# Altium schematic sheet Motor_Driver.SchDoc
size A3; DocumentNumber: 2; SheetNumber: 2; SheetTotal: 11
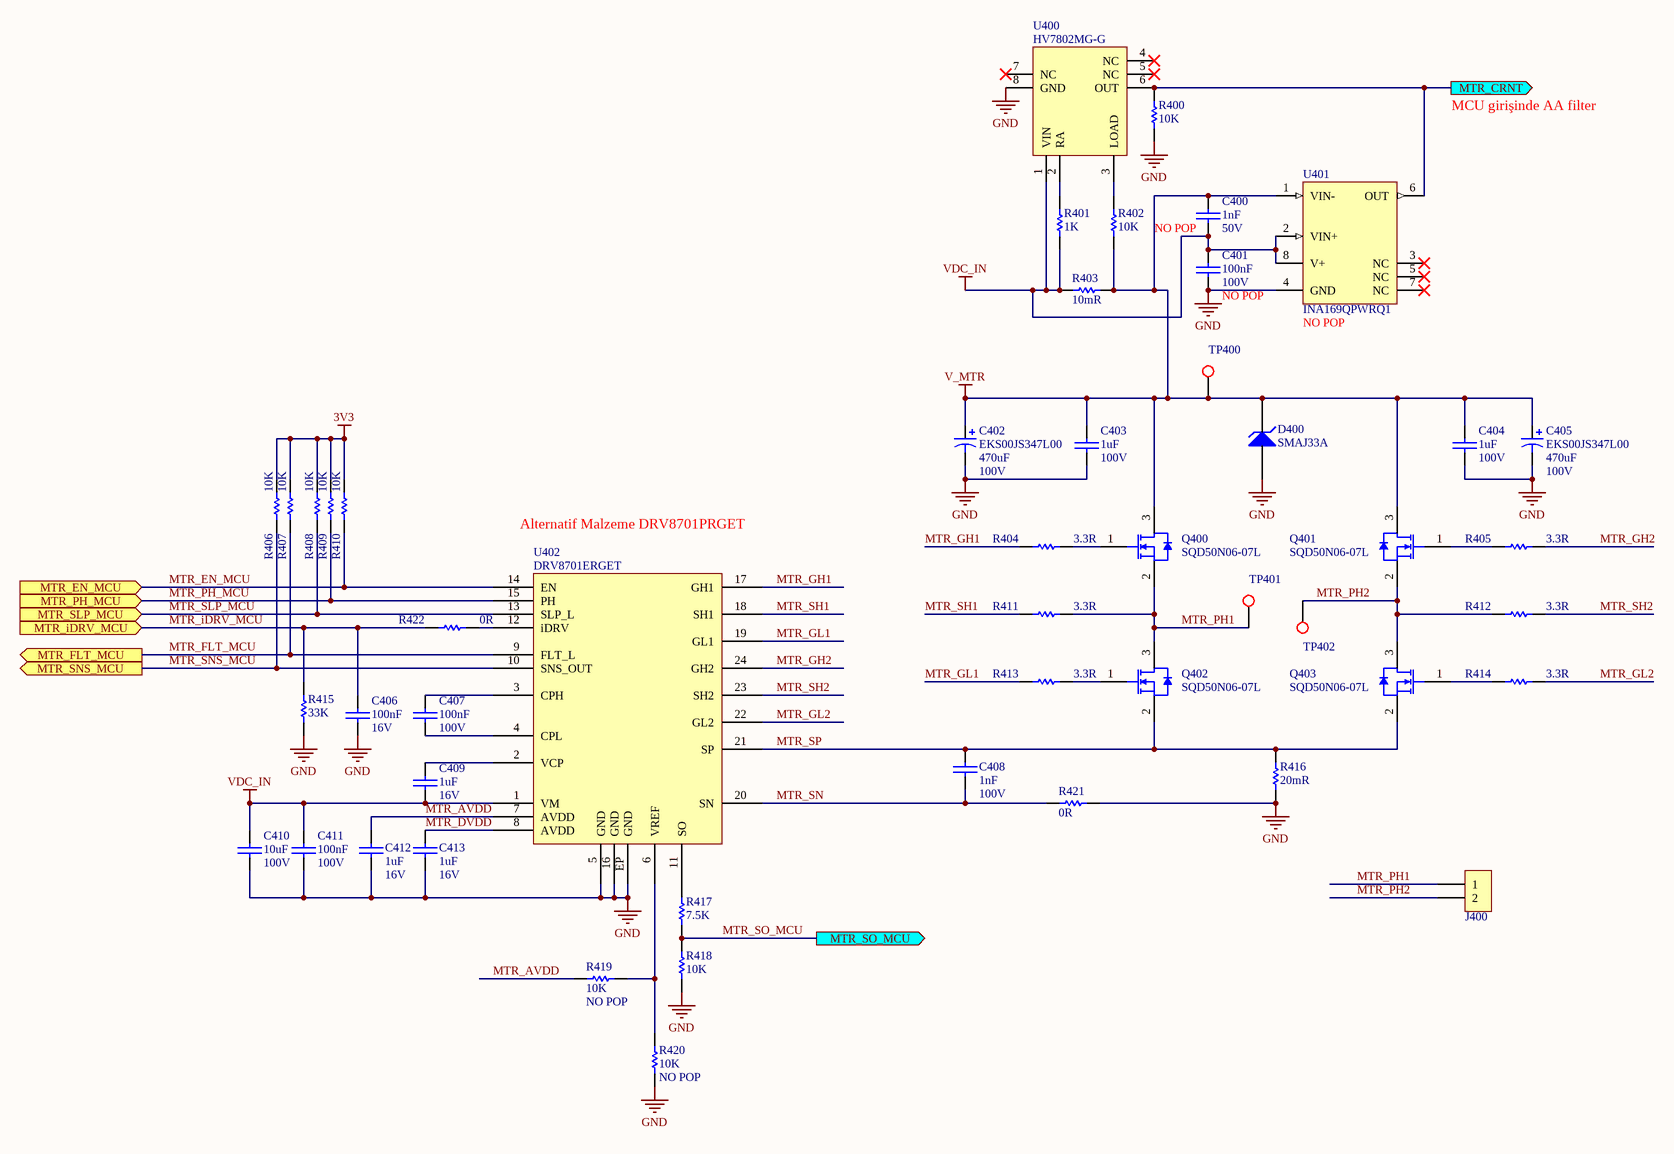
[diagram p0: Motor_Driver.SchDoc]

## Parts
C400  Operating Voltage: 50V  Assembly: NO POP  [CAPC1005X06N]  (hidden comment: 1nF)
C401  Operating Voltage: 100V  Assembly: NO POP  [CAPC3216X09N]  (hidden comment: 100nF)
C402  EKS00JS347L00  value 470uF  Rated Voltage: 100V  [CAPPR7.5-16X31.5]
C403  Operating Voltage: 100V  [CAPC3216X09N]  (hidden comment: 1uF)
C404  Operating Voltage: 100V  [CAPC3216X09N]  (hidden comment: 1uF)
C405  EKS00JS347L00  value 470uF  Rated Voltage: 100V  [CAPPR7.5-16X31.5]
C406  Operating Voltage: 16V  [CAPC1005X06N]  (hidden comment: 100nF)
C407  Operating Voltage: 100V  [CAPC3216X09N]  (hidden comment: 100nF)
C408  Operating Voltage: 100V  [CAPC1608X09N]  (hidden comment: 1nF)
C409  Operating Voltage: 16V  [CAPC2012X14N]  (hidden comment: 1uF)
C410  Operating Voltage: 100V  [CAPC5750X25N]  (hidden comment: 10uF)
C411  Operating Voltage: 100V  [CAPC3216X09N]  (hidden comment: 100nF)
C412  Operating Voltage: 16V  [CAPC2012X14N]  (hidden comment: 1uF)
C413  Operating Voltage: 16V  [CAPC2012X14N]  (hidden comment: 1uF)
D400  SMAJ33A  [DIOM5226X23N]
J400  (no value)  [AJ61-1002-TAPR-RNS0]
Q400  SQD50N06-07L  [TO228P970-3N]
Q401  SQD50N06-07L  [TO228P970-3N]
Q402  SQD50N06-07L  [TO228P970-3N]
Q403  SQD50N06-07L  [TO228P970-3N]
R400  10K  [RESC1005X04N]
R401  1K  [RESC1005X04N]
R402  10K  [RESC1005X04N]
R403  10mR  [RESC3216X08N]
R404  3.3R  [RESC2012X07N]
R405  3.3R  [RESC2012X07N]
R406  10K  [RESC1005X04N]
R407  10K  [RESC1005X04N]
R408  10K  [RESC1005X04N]
R409  10K  [RESC1005X04N]
R410  10K  [RESC1005X04N]
R411  3.3R  [RESC2012X07N]
R412  3.3R  [RESC2012X07N]
R413  3.3R  [RESC2012X07N]
R414  3.3R  [RESC2012X07N]
R415  33K  [RESC1005X04N]
R416  20mR  [RESC3216X08N]
R417  7.5K  [RESC1005X04N]
R418  10K  [RESC1005X04N]
R419  Assembly: NO POP  [RESC1005X04N]  (hidden comment: 10K)
R420  Assembly: NO POP  [RESC1005X04N]  (hidden comment: 10K)
R421  0R  [RESC2012X07N]
R422  0R  [RESC1005X04N]
TP400  AEMT-C00S-1000-0000  [TP100]  (value not drawn)
TP401  AEMT-C00S-1000-0000  [TP100]  (value not drawn)
TP402  AEMT-C00S-1000-0000  [TP100]  (value not drawn)
U400  HV7802MG-G  [MSOP65P490X110-8N]
U401  Assembly: NO POP  [TSOP65P640X120-8N]  (hidden comment: INA169QPWRQ1)
U402  DRV8701ERGET  [QFN50P400X400X100_HS-25N]

## Ports
MTR_CRNT (out), MTR_EN_MCU (in), MTR_FLT_MCU (out), MTR_iDRV_MCU (in), MTR_PH_MCU (in), MTR_SLP_MCU (in), MTR_SNS_MCU (out), MTR_SO_MCU (out)

## Nets
3V3: R406.2 R407.2 R408.2 R409.2 R410.2
GND: C401.1 C402.2 C403.1 C404.1 C405.2 C406.1 C410.1 C411.1 C412.1 C413.1 D400.2(A) R400.1 R415.1 R416.1 R418.2 R420.1 R421.2 U400.8(GND) U401.4(GND) U402.5(GND) U402.16(GND) U402.EP(GND)
V_MTR: C400.2 C402.1 C403.2 C404.2 C405.1 D400.1(K) Q400.3(Drain) Q401.3(Drain) R402.1 R403.2 TP400.1 U401.1(VIN-)
VDC_IN: C400.1 C401.2 C409.1 C410.2 C411.2 R401.1 R403.1 U400.1(VIN) U401.2(VIN+) U401.8(V+) U402.1(VM)
MTR_AVDD: C412.2 R419.2 U402.7(AVDD)
MTR_CRNT: R400.2 U400.6(OUT) U401.6(OUT) ; port MTR_CRNT
MTR_DVDD: C413.2 U402.8(AVDD)
MTR_EN_MCU: R410.1 U402.14(EN) ; port MTR_EN_MCU
MTR_FLT_MCU: R407.1 U402.9(FLT_L) ; port MTR_FLT_MCU
MTR_GH1: R404.1 U402.17(GH1)
MTR_GH2: R405.2 U402.24(GH2)
MTR_GL1: R413.1 U402.19(GL1)
MTR_GL2: R414.2 U402.22(GL2)
MTR_iDRV_MCU: C406.2 R415.2 R422.1 ; port MTR_iDRV_MCU
MTR_PH1: J400.1 Q400.2(Source) Q402.3(Drain) R411.2 TP401.1
MTR_PH2: J400.2 Q401.2(Source) Q403.3(Drain) R412.1 TP402.1
MTR_PH_MCU: R409.1 U402.15(PH) ; port MTR_PH_MCU
MTR_SH1: R411.1 U402.18(SH1)
MTR_SH2: R412.2 U402.23(SH2)
MTR_SLP_MCU: R408.1 U402.13(SLP_L) ; port MTR_SLP_MCU
MTR_SN: C408.1 R421.1 U402.20(SN)
MTR_SNS_MCU: R406.1 U402.10(SNS_OUT) ; port MTR_SNS_MCU
MTR_SO_MCU: R417.1 R418.1 ; port MTR_SO_MCU
MTR_SP: C408.2 Q402.2(Source) Q403.2(Source) R416.2 U402.21(SP)
NetC407_1: C407.1 U402.4(CPL)
NetC407_2: C407.2 U402.3(CPH)
NetC409_2: C409.2 U402.2(VCP)
NetQ400_1: Q400.1(Gate) R404.2
NetQ401_1: Q401.1(Gate) R405.1
NetQ402_1: Q402.1(Gate) R413.2
NetQ403_1: Q403.1(Gate) R414.1
NetR401_2: R401.2 U400.2(RA)
NetR402_2: R402.2 U400.3(LOAD)
NetR417_2: R417.2 U402.11(SO)
NetR419_1: R419.1 R420.2 U402.6(VREF)
NetR422_2: R422.2 U402.12(iDRV)

Not connected (* = marked no-connect by the designer): U400 4(NC)* 5(NC)* 7(NC)*; U401 3(NC)* 5(NC)* 7(NC)*

## Notes on the sheet
- MCU girişinde AA filter
- Alternatif Malzeme DRV8701PRGET
- Title
- Size:
- Date:
- A3
- Number:
- Time:
- Revision:
- Sheet
- of
- File:

## Library data of the parts
C400 = ACC0-0100-S272-0000: CAP, CER, C0G, 1nF, %5, 50V, 0402; Manufacturer: Murata; Manufacturer Part Number: GRM1555C1H102JA01D; CR: 000049; Requested by: MU; Lead Finish: Pb Free; Material: Ceramic, C0G; Definition Date: 14.08.2012; Revision Date: *; Price: *; Supplier: *; Supplier Part Number: *; DS: 000049; Operating Temp: -55 to 125 C; Storage Temp: -55 to 125 C; Status: Active; Package Reference: EIA 0402, Metric 1005; Component Type: Capacitor; Footprint Type: SMD; Published by: MU; ESR: *; FR: *; Value: 1nF
C401 C407 C411 = ACC7-2100-S791-0000: CAP, CER, X7R, 100nF, %10, 100V, 1206; Manufacturer: KEMET; Manufacturer Part Number: C1206C104K1RACTU; CR: 000211/89; Requested by: OO; DS: 000211; Lead Finish: Pb Free; Published by: MU; Material: Ceramic, X7R; Definition Date: 18.02.2013; Revision Date: *; Price: *; Supplier: *; Supplier Part Number: *; Operating Temp: -55 to 125 C; Storage Temp: -55 to 125 C; Status: Active; Package Reference: EIA 1206, Metric 3216; Component Type: Capacitor; Footprint Type: SMD; ESR: *; FR: *; Value: 100nF
C402 C405 = EKS00JS347L00: Aluminum Electrolytic Capacitor, Radial Style with Long Leads: 470uF, 100V; Note: Refer to Manufacturer's Data Sheets for other lead formations; DrillSize: Nominal, Rounded To The Nearest 0.1mm; Published: 19-Mar-2004; DatasheetDocument: 30-May-2000; PackageReference: CAPPR7.5-16X31.5; Publisher: Altium Limited; ComponentLink1Description: Manufacturer Link; ComponentLink1URL: http://www.vishay.com/; ComponentLink2Description: Datasheet; ComponentLink2URL: http://www.vishay.com/docs/25007/eks.pdf
C403 C404 = ACC7-3100-S691-0000: CAP, CER, X7R, 1uF, %10, 100V, 1206; Manufacturer: Murata; Manufacturer Part Number: GRM31CR72A105KA01L; CR: 344; Requested by: NK; DS: 00049; Lead Finish: Pb Free; Published by: IS; Material: Ceramic, X7R; Definition Date: 13.02.2014; Revision Date: *; Price: *; Supplier: *; Supplier Part Number: *; Operating Temp: -55 to 125 C; Storage Temp: -55 to 125 C; Status: Active; Package Reference: EIA 1206, Metric 3216; Component Type: Capacitor; Footprint Type: SMD; ESR: *; FR: *; Value: 1uF
C406 = ACC7-2100-S241-0000: CAP, CER, X7R, 100nF, %10, 16V, 0402; Manufacturer: Murata; Manufacturer Part Number: GRM155R71C104KA88D; CR: 000049; Requested by: MU; Lead Finish: Pb Free; Material: Ceramic, X7R; Definition Date: 14.08.2012; Revision Date: *; Price: *; Supplier: *; Supplier Part Number: *; DS: 000049; Operating Temp: -55 to 125 C; Storage Temp: -55 to 125 C; Status: Active; Package Reference: EIA 0402, Metric 1005; Component Type: Capacitor; Footprint Type: SMD; Published by: MU; ESR: *; FR: *; Value: 100nF
C408 = ACC7-0100-S391-0000: CAP, CER, X7R, 1nF, %10, 100V, 0603; Manufacturer: Murata; Manufacturer Part Number: GRM188R72A102KA01D; CR: 000049; Requested by: MU; Lead Finish: Pb Free; Material: Ceramic, X7R; Definition Date: 14.08.2012; Revision Date: 25.06.2013; Price: *; Supplier: *; Supplier Part Number: *; DS: 000049; Operating Temp: -55 to 125 C; Storage Temp: -55 to 125 C; Status: Active; Package Reference: EIA 0603, Metric 1608; Component Type: Capacitor; Footprint Type: SMD; Published by: MU; ESR: *; FR: *; Value: 1nF
C409 C412 C413 = ACC7-3100-S441-0000: CAP, CER, X7R, 1uF, %10, 16V, 0805; Manufacturer: Murata; Manufacturer Part Number: GRM21BR71C105KA01L; CR: 000049; Requested by: MU; Lead Finish: Pb Free; Material: Ceramic, X7R; Definition Date: 14.08.2012; Revision Date: *; Price: *; Supplier: *; Supplier Part Number: *; DS: 000049; Operating Temp: -55 to 125 C; Storage Temp: -55 to 125 C; Status: Active; Package Reference: EIA 0805, Metric 2012; Component Type: Capacitor; Footprint Type: SMD; Published by: MU; ESR: *; FR: *; Value: 1uF
C410 = ACC4-4100-SD91-0000: CAP, CER, X7S, 10uF, %10, 100V, 2220; Manufacturer: TDK; Manufacturer Part Number: CGA9N3X7S2A106K230KB; CR: 232; Requested by: MU; DS: 000310; Lead Finish: Pb Free; Material: Ceramic, X7S; Definition Date: 23.08.2013; Revision Date: *; Price: *; Supplier: *; Supplier Part Number: *; Operating Temp: -55 to 125 C; Storage Temp: -55 to 125 C; Status: Active; Package Reference: EIA 5750, Metric 2220; Component Type: Capacitor; Footprint Type: SMD; Published by: MU; FR: *; Value: 10uF
D400 = AS1H-975M-SI60-0001: Diode, TVS, 3.5V @35A, 33V, 400W,  Uni-directional, DO-214AC; Manufacturer Part Number: SMAJ33A-13-F; Manufacturer: Diodes; CR: 000065/122; DS: 000065; Lead Finish: Pb Free; Published by: MU; Requested by: NK; Price: *; Definition Date: 22.03.2013; Footprint Type: SMD; JEDEC Code: *; Operating Temp: -55 to 150 C; Package Reference: DO-214AC; Revision Date: *; Status: Active; Storage Temp: -55 to 175 C; Supplier: *; Supplier Part Number: *; Component Type: DIODE; Forward Voltage: 3.5V @35A; Reverse Voltage: 33 V; Value: SMAJ33A
J400 = AJ61-1002-TAPR-RNS0: CON, Terminal, Klemens, 2 Pins, 1-Row, 5.08mm, TH, P, R; Manufacturer: ON-SHORE; Manufacturer Part Number: OSTOQ025451; Requested by: NK; Lead Finish: Pb Free; Max. Operating Voltage: 250VAC; Rated Current: 15A; CR: -; Definition Date: 11.08.2015; Revision Date: *; Price: *; Supplier: *; Supplier Part Number: *; DS: -; Operating Temp: -30, +105; Storage Temp: -30, +105; Status: Active; Package Reference: *; Component Type: Connector; Footprint Type: TH; Published by: NK; JEDEC Code: *; Material: *
Q400-Q403 = AS26-A50M-SI40-0000: Transistor, MOSFET, N, 60V, 50A, 7.6mR, SQD50N06-07L, TO-252; Manufacturer Part Number: SQD50N06-07L-GE3; Manufacturer: VISHAY; CR: 000207/85; DS: 000207; Lead Finish: Pb Free; Published by: MU; Requested by: MAY; Vgs(max): +-20V; Price: *; Definition Date: 18.02.2013; Footprint Type: SMD; JEDEC Code: TO-252; Operating Temp: -55 to 175 C; Package Reference: TO-252; Revision Date: *; Status: Active; Storage Temp: -55 to 175 C; Supplier: *; Supplier Part Number: *; Component Type: TRS/MOSFET; Vds(max): 60V; Id: 50A; Value: SQD50N06-07L
R400 R402 R406-R410 R418-R420 = AR19-4100-S2B2-0000: RES, E24, Thick Film, SMD, 10K, 1%, 0.1W, 0402; Manufacturer: Panasonic; Manufacturer Part Number: ERJ-2RKF1002X; CR: DS00073; Requested by: MU; Lead Finish: Pb Free; Max. Operating Voltage: 50V; Definition Date: 16.08.2012; Revision Date: *; Price: *; Supplier: *; Supplier Part Number: *; DS: DS00073; Operating Temp: -55 to 155 C; Storage Temp: -55 to 155 C; Status: Active; Package Reference: EIA 0402, Metric 1005; Component Type: Resistor; Footprint Type: SMD; Published by: MU; JEDEC Code: *; Material: Thick Film; ESR: *; FR: *; Power Rating: 0.1W; Value: 10K
R401 = AR19-3100-S2B2-0000: RES, E24, Thick Film, SMD, 1K, 1%, 0.1W, 0402; Manufacturer: Panasonic; Manufacturer Part Number: ERJ-2RKF1001X; CR: DS00073; Requested by: MU; Lead Finish: Pb Free; Max. Operating Voltage: 50V; Definition Date: 16.08.2012; Revision Date: *; Price: *; Supplier: *; Supplier Part Number: *; DS: DS00073; Operating Temp: -55 to 155 C; Storage Temp: -55 to 155 C; Status: Active; Package Reference: EIA 0402, Metric 1005; Component Type: Resistor; Footprint Type: SMD; Published by: MU; JEDEC Code: *; Material: Thick Film; ESR: *; FR: *; Power Rating: 0.1W; Value: 1K
R403 = AR19-Y100-S5D2-0000: RES, Thick Film, SMD, 10mR, 1%, 1W, 1206; Manufacturer: Panasonic; Manufacturer Part Number: ERJ-8BWFR010V; CR: 000078/95; Requested by: MU; DS: 000078; Lead Finish: Pb Free; Max. Operating Voltage: 0.40; Definition Date: 19.02.2013; Revision Date: *; Price: *; Supplier: *; Supplier Part Number: *; Operating Temp: -55 to 155 C; Storage Temp: -55 to 155 C; Status: Active; Package Reference: EIA 1206, Metric 3216; Component Type: Resistor; Footprint Type: SMD; Published by: MU; JEDEC Code: *; Material: Thick Film; ESR: *; FR: *; Power Rating: 1W; Value: 10mR
R404 R405 R411-R414 = AR19-0330-S4D2-0000: RES, E24, Thick Film, SMD, 3.3R, 1%, 0.125W, 0805; Manufacturer: Panasonic; Manufacturer Part Number: ERJ-6RQF3R3V; CR: 000201; Requested by: MAY; Lead Finish: Pb Free; Published by: MU; Definition Date: 16.02.2013; Revision Date: *; Price: *; Supplier: *; Supplier Part Number: *; DS: 000201; Operating Temp: -55 to 155 C; Storage Temp: -55 to 155 C; Status: Active; Package Reference: EIA 0805, Metric 2012; Component Type: Resistor; Footprint Type: SMD; JEDEC Code: *; Material: Thick Film; ESR: *; FR: *; Max. Operating Voltage: *; Power Rating: 0.125W; Value: 3.3R
R415 = AR19-4330-S2B2-0000: RES, E24, Thick Film, SMD, 33K, 1%, 0.1W, 0402; Manufacturer: Panasonic; Manufacturer Part Number: ERJ-2RKF3302X; CR: DS00073; Requested by: MU; Lead Finish: Pb Free; Max. Operating Voltage: 50V; Definition Date: 16.08.2012; Revision Date: *; Price: *; Supplier: *; Supplier Part Number: *; DS: DS00073; Operating Temp: -55 to 155 C; Storage Temp: -55 to 155 C; Status: Active; Package Reference: EIA 0402, Metric 1005; Component Type: Resistor; Footprint Type: SMD; Published by: MU; JEDEC Code: *; Material: Thick Film; ESR: *; FR: *; Power Rating: 0.1W; Value: 33K
R416 = AR19-Y200-S5D2-0000: RES, Thick Film, SMD, 20mR, 1%, 1W, 1206; Manufacturer: Panasonic; Manufacturer Part Number: ERJ-8BWFR020V; CR: 000078; Requested by: MU; Lead Finish: Pb Free; Max. Operating Voltage: 0.40; Definition Date: 19.02.2013/95; Revision Date: *; Price: *; Supplier: *; Supplier Part Number: *; DS: 000078; Operating Temp: -55 to 155 C; Storage Temp: -55 to 155 C; Status: Active; Package Reference: EIA 1206, Metric 3216; Component Type: Resistor; Footprint Type: SMD; Published by: MU; JEDEC Code: *; Material: Thick Film; ESR: *; FR: *; Power Rating: 1W; Value: 20mR
R417 = AR19-3750-S2B2-0000: RES, E24, Thick Film, SMD, 7.5K, 1%, 0.1W, 0402; Manufacturer: Panasonic; Manufacturer Part Number: ERJ-2RKF7501X; CR: DS00073; Requested by: MU; Lead Finish: Pb Free; Max. Operating Voltage: 50V; Definition Date: 16.08.2012; Revision Date: *; Price: *; Supplier: *; Supplier Part Number: *; DS: DS00073; Operating Temp: -55 to 155 C; Storage Temp: -55 to 155 C; Status: Active; Package Reference: EIA 0402, Metric 1005; Component Type: Resistor; Footprint Type: SMD; Published by: MU; JEDEC Code: *; Material: Thick Film; ESR: *; FR: *; Power Rating: 0.1W; Value: 7.5K
R421 = AR19-0000-S407-0000: RES, Thick Film, SMD, 0R, Jumper, 0.125W, 0805; Manufacturer: Panasonic; Manufacturer Part Number: ERJ-6GEY0R00V; CR: 000062; Requested by: MAY; Lead Finish: Pb Free; Published by: MU; Max. Operating Voltage: 150V; Definition Date: 09.11.2012; Revision Date: *; Price: *; Supplier: *; Supplier Part Number: *; DS: 000062; Operating Temp: -55 to 155 C; Storage Temp: -55 to 155 C; Status: Active; Package Reference: EIA 0805, Metric 2012; Component Type: Resistor; Footprint Type: SMD; JEDEC Code: *; Material: Thick Film; ESR: *; FR: *; Power Rating: 0.125W; Value: 0R
R422 = AR19-0000-S201-0000: RES, Thick Film, SMD, 0R, Jumper, 0.1W, 0402; Manufacturer: Panasonic; Manufacturer Part Number: ERJ-2GE0R00X; CR: 000062; Requested by: MAY; Lead Finish: Pb Free; Published by: MU; Max. Operating Voltage: 50V; Definition Date: 09.07.2012; Revision Date: *; Price: *; Supplier: *; Supplier Part Number: *; DS: 000062; Operating Temp: -55 to 155 C; Storage Temp: -55 to 155 C; Status: Active; Package Reference: EIA 0402, Metric 1005; Component Type: Resistor; Footprint Type: SMD; JEDEC Code: *; Material: Thick Film; ESR: *; FR: *; Power Rating: 0.1W; Value: 0R
TP400-TP402 = AEMT-C00S-1000-0000: Test Point, Circular, 1mm; Text: TEST_POINT
U400 = AT82-0000-SMC0-1860: IC, PMIC, Current Monitor, HV7802MG-G, MSOP-8; Manufacturer: Microchip; JEDEC Code: MO-187; Lead Finish: Pb Free; Published by: NK; Component Type: IC; CR: -; Definition Date: 01.08.2015; DS: -; Footprint Type: SMD; Manufacturer Part Number: HV7802MG-G; Operating Temp: -40°C to 85°C; Package Reference: MSOP-8; Price: *; Requested by: NK; Revision Date: -; Status: Active; Storage Temp: -65°C to 150°C; Supplier: *; Supplier Part Number: *; FR: *; Value: HV7802MG-G
U401 = AT82-0000-SM90-0690: IC, PMIC, Current Monitor, INA169QPWRQ1, TSSOP-8; Manufacturer: Texas Instruments; CR: 000177; JEDEC Code: MO-153; Lead Finish: Pb Free; Published by: MU; Requested by: OO; Component Type: IC; Definition Date: 20.12.2012; DS: 000177; Footprint Type: SMD; Manufacturer Part Number: INA169QPWRQ1; Operating Temp: -40°C to 125°C; Package Reference: TSSOP-8; Price: *; Revision Date: 27.05.2013; Status: Active; Storage Temp: -65°C to 150°C; Supplier: *; Supplier Part Number: *; FR: *; Value: INA169QPWRQ1
U402 = AT8B-0000-SF60-1850: IC, PMIC, Motor Driver, PWM Input, DRV8701ERGET, PQFN-24; Manufacturer: Texas Instruments; Published by: NK; Component Type: IC; CR: -; Definition Date: 25.07.2015; DS: -; Footprint Type: SMD; Manufacturer Part Number: DRV8701ERGET; Operating Temp: -40, +125; Package Reference: PQFN-24; Requested by: NK; Status: Active